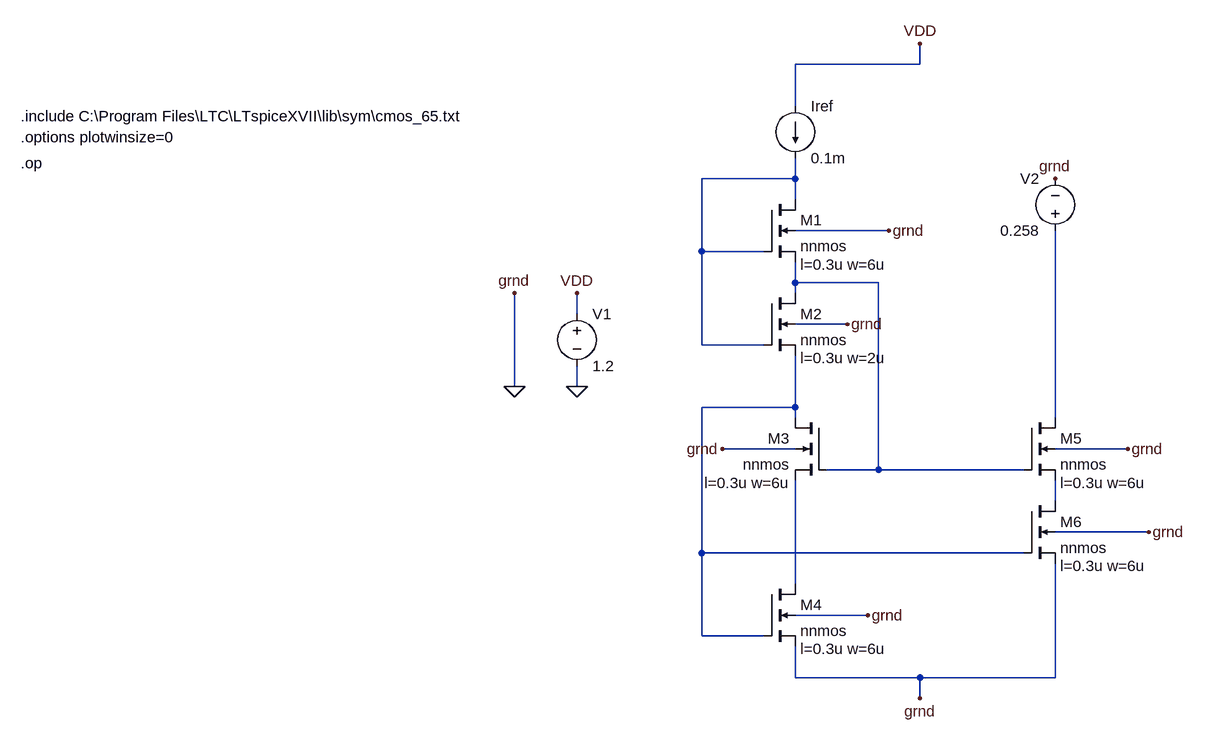
[diagram p0: schematic sooch_mirror.asc]
sooch_mirror.asc, the LTspice schematic file:
Version 4
SHEET 1 1028 896
WIRE 224 -192 224 -224
WIRE 224 -192 32 -192
WIRE 32 -128 32 -192
WIRE 32 -16 32 -48
WIRE 32 -16 -112 -16
WIRE 32 16 32 -16
WIRE 176 64 32 64
WIRE -112 96 -112 -16
WIRE -16 96 -112 96
WIRE 32 144 32 112
WIRE 160 144 32 144
WIRE 32 160 32 144
WIRE -304 192 -304 160
WIRE 112 208 32 208
WIRE -112 240 -112 96
WIRE -16 240 -112 240
WIRE -400 304 -400 160
WIRE -304 304 -304 272
WIRE 32 336 32 256
WIRE 32 336 -112 336
WIRE 32 352 32 336
WIRE 432 352 432 64
WIRE 32 400 -80 400
WIRE 544 400 432 400
WIRE 160 432 160 144
WIRE 160 432 80 432
WIRE 384 432 160 432
WIRE 432 480 432 448
WIRE 576 528 432 528
WIRE -112 560 -112 336
WIRE 384 560 -112 560
WIRE 32 608 32 448
WIRE 144 656 32 656
WIRE -112 688 -112 560
WIRE -16 688 -112 688
WIRE 32 752 32 704
WIRE 224 752 32 752
WIRE 432 752 432 576
WIRE 432 752 224 752
WIRE 224 784 224 752
FLAG -400 304 0
FLAG -304 304 0
FLAG -304 160 VDD
FLAG 224 -224 VDD
FLAG -400 160 grnd
FLAG 224 784 grnd
FLAG 176 64 grnd
FLAG 112 208 grnd
FLAG -80 400 grnd
FLAG 144 656 grnd
FLAG 544 400 grnd
FLAG 576 528 grnd
FLAG 432 -16 grnd
SYMBOL nmos4 -16 16 R0
WINDOW 123 56 100 Left 2
SYMATTR InstName M1
SYMATTR Value nnmos
SYMATTR Value2 l=0.3u w=6u
SYMBOL nmos4 -16 160 R0
WINDOW 123 56 100 Left 2
SYMATTR InstName M2
SYMATTR Value nnmos
SYMATTR Value2 l=0.3u w=2u
SYMBOL nmos4 80 352 M0
WINDOW 123 56 100 Left 2
SYMATTR InstName M3
SYMATTR Value nnmos
SYMATTR Value2 l=0.3u w=6u
SYMBOL nmos4 -16 608 R0
WINDOW 123 56 100 Left 2
SYMATTR InstName M4
SYMATTR Value nnmos
SYMATTR Value2 l=0.3u w=6u
SYMBOL nmos4 384 352 R0
WINDOW 123 56 100 Left 2
SYMATTR InstName M5
SYMATTR Value nnmos
SYMATTR Value2 l=0.3u w=6u
SYMBOL nmos4 384 480 R0
WINDOW 123 56 100 Left 2
SYMATTR InstName M6
SYMATTR Value nnmos
SYMATTR Value2 l=0.3u w=6u
SYMBOL current 32 -128 R0
WINDOW 123 0 0 Left 0
WINDOW 39 0 0 Left 0
SYMATTR InstName Iref
SYMATTR Value 0.1m
SYMBOL voltage -304 176 R0
WINDOW 123 0 0 Left 0
WINDOW 39 0 0 Left 0
SYMATTR InstName V1
SYMATTR Value 1.2
SYMBOL voltage 432 80 R180
WINDOW 0 24 96 Left 2
WINDOW 3 24 16 Left 2
WINDOW 123 0 0 Left 0
WINDOW 39 0 0 Left 0
SYMATTR InstName V2
SYMATTR Value 0.258
TEXT -1160 -112 Left 2 !.include C:\\Program Files\\LTC\\LTspiceXVII\\lib\\sym\\cmos_65.txt
TEXT -1160 -80 Left 2 !.options plotwinsize=0
TEXT -1160 -40 Left 2 !.op

The netlist it stands for:
* sooch_mirror.asc
M1 N001 N001 N002 0 nnmos l=0.3u w=6u
M2 N002 N001 N003 0 nnmos l=0.3u w=2u
M3 N003 N002 N006 0 nnmos l=0.3u w=6u
M4 N006 N003 0 0 nnmos l=0.3u w=6u
M5 N004 N002 N005 0 nnmos l=0.3u w=6u
M6 N005 N003 0 0 nnmos l=0.3u w=6u
Iref VDD N001 0.1m
V1 VDD 0 1.2
V2 N004 0 0.258
.model NMOS NMOS
.model PMOS PMOS
.lib standard.mos
.include C:\Program Files\LTC\LTspiceXVII\lib\sym\cmos_65.txt
.options plotwinsize=0
.op
.backanno
.end